# EAGLE schematic TopfieldClock (EAGLE 6.2)
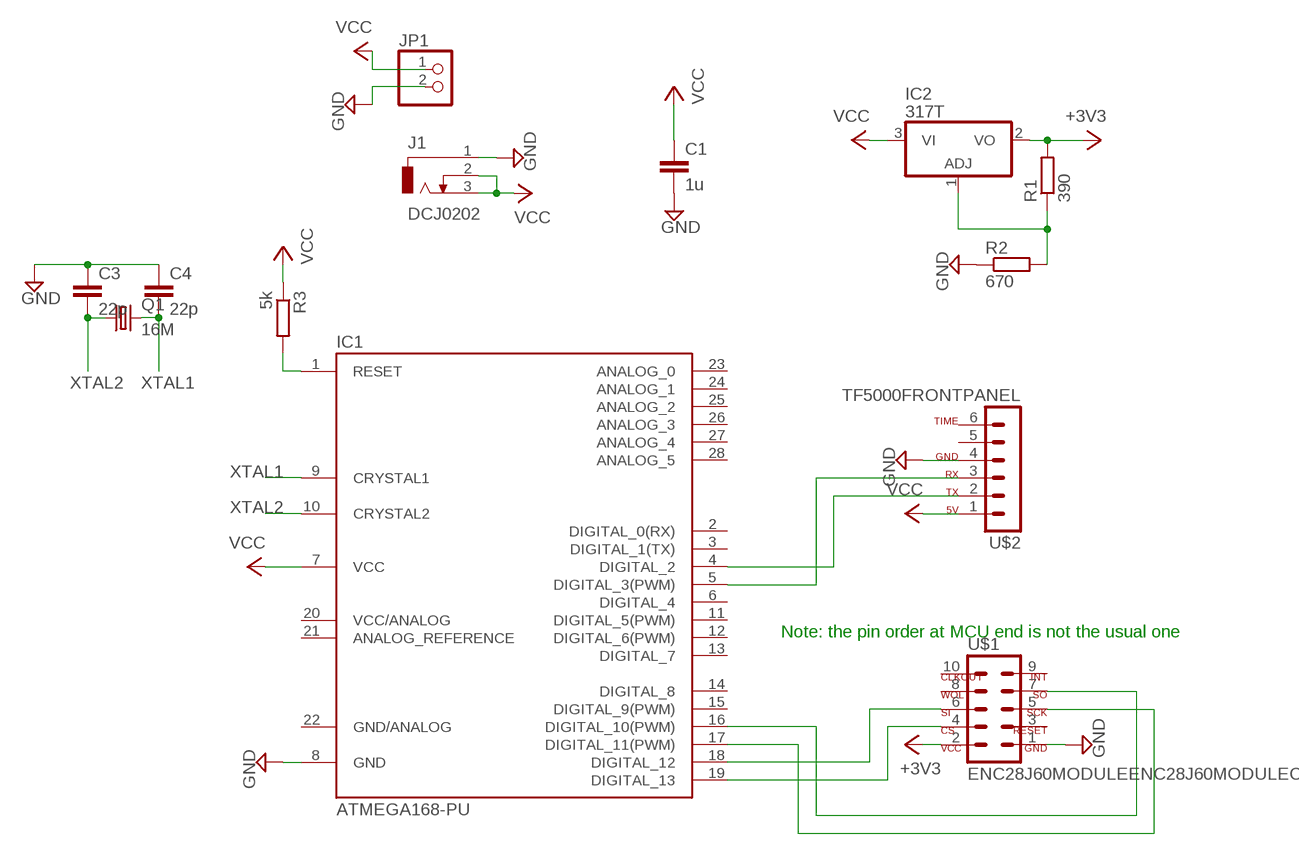
[diagram p0: schematic, sheet 1]

## Parts
C1  1u  C-EU025-024X044  [C025-024X044]
C3  22p  C-EU025-024X044  [C025-024X044]
C4  22p  C-EU025-024X044  [C025-024X044]
IC1  ATMEGA168-PU  [DIL28-3]
IC2  317T  [TO220H]
J1  DCJ0202  [DCJ0202]
JP1  PINHD-1X2/90  [1X02/90]
Q1  16M  CRYSTALHC18U-V  [HC18U-V]
R1  390  R-EU_0204/7  [0204/7]
R2  670  R-EU_0204/7  [0204/7]
R3  5k  R-EU_0204/7  [0204/7]
U$1  ENC28J60MODULEENC28J60MODULECONN  [ENC28J60MODULECONN]
U$2  TF5000FRONTPANEL  [MA06-1]

## Nets
+3V3: IC2.2(VO) R1.2 U$1.2(VCC)
GND: C1.2 C3.1 C4.1 IC1.8(GND) J1.1 JP1.2 R2.1 U$1.1(GND) U$2.4(YELLOW_GND)
N$1: IC1.4(DIGITAL_2) U$2.2(RED_OUTPUT)
N$2: IC1.19(DIGITAL_13) U$1.4(CS)
N$3: IC1.17(DIGITAL_11(PWM)) U$1.5(SCK)
N$4: IC1.18(DIGITAL_12) U$1.6(SI)
N$5: IC1.5(DIGITAL_3(PWM)) U$2.3(ORANGE_INPUT)
N$6: IC1.16(DIGITAL_10(PWM)) U$1.7(SO)
N$7: IC2.1(ADJ) R1.1 R2.2
N$8: IC1.1(RESET) R3.2
VCC: C1.1 IC1.7(VCC) IC2.3(VI) J1.2 J1.3 JP1.1 R3.1 U$2.1(BROWN_5V)
XTAL1: C4.2 IC1.9(CRYSTAL1) Q1.2
XTAL2: C3.2 IC1.10(CRYSTAL2) Q1.1
Unconnected: IC1.2(DIGITAL_0(RX)) IC1.3(DIGITAL_1(TX)) IC1.6(DIGITAL_4) IC1.11(DIGITAL_5(PWM)) IC1.12(DIGITAL_6(PWM)) IC1.13(DIGITAL_7) IC1.14(DIGITAL_8) IC1.15(DIGITAL_9(PWM)) IC1.20(VCC/ANALOG) IC1.21(ANALOG_REFERENCE) IC1.23(ANALOG_0) IC1.24(ANALOG_1) IC1.25(ANALOG_2) IC1.26(ANALOG_3) IC1.27(ANALOG_4) IC1.28(ANALOG_5) U$1.3(RESET) U$1.8(WOL) U$1.9(INT) U$1.10(CLKOUT) U$2.5(GREEN) U$2.6(BLUE_TIME)

## Notes on the sheet
- Note: the pin order at MCU end is not the usual one

## Power pins joined to a net without a drawn wire
GND/ANALOG: IC1.22(GND/ANALOG)

## Library data of the parts
C1 C3 C4 = rcl:C-EU: CAPACITOR, European symbol
IC1 = Arduino-AVR:ATMEGA168-PU
IC2 = linear:*317: Positive VOLTAGE REGULATOR
J1 = con-jack:DCJ0202: DC POWER JACK Source: DCJ0202.pdf; OC_FARNELL: unknown; OC_NEWARK: unknown
JP1 = pinhead:PINHD-1X2: PIN HEADER
Q1 = crystal:CRYSTAL: CRYSTAL; OC_FARNELL: unknown; OC_NEWARK: unknown
R1-R3 = rcl:R-EU_: RESISTOR, European symbol
U$1 = flux:ENC28J60MODULE
U$2 = flux:TF5000FRONTPANEL